# Altium schematic sheet TPS54561_5V_5A_buck.SchDoc
size B; Organization: CWRUbotix; Address1: 10900 Euclid Avenue; Address2: Cleveland, OH 44106; Address3: USA
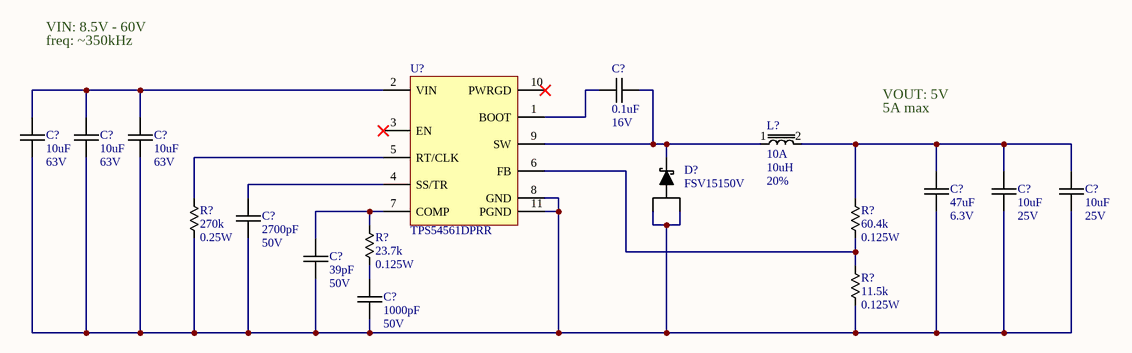
[diagram p0: TPS54561_5V_5A_buck.SchDoc]

## Parts
(Parts that share a designator on the sheet are numbered #1, #2 ... from top to bottom, then left to right.)
C?#1  Capacitance: 0.1uF  Voltage Rating: 16V  [chip_0603]  (hidden comment: cap_single_np)
C?#2  Capacitance: 10uF  Voltage Rating: 63V  [chip_1210]  (hidden comment: cap_single_np)
C?#3  Capacitance: 10uF  Voltage Rating: 63V  [chip_1210]  (hidden comment: cap_single_np)
C?#4  Capacitance: 10uF  Voltage Rating: 63V  [chip_1210]  (hidden comment: cap_single_np)
C?#5  Capacitance: 47uF  Voltage Rating: 6.3V  [chip_1210]  (hidden comment: cap_single_np)
C?#6  Capacitance: 10uF  Voltage Rating: 25V  [chip_1206]  (hidden comment: cap_single_np)
C?#7  Capacitance: 10uF  Voltage Rating: 25V  [chip_1206]  (hidden comment: cap_single_np)
C?#8  Capacitance: 2700pF  Voltage Rating: 50V  [chip_0603]  (hidden comment: cap_single_np)
C?#9  Capacitance: 39pF  Voltage Rating: 50V  [chip_0603]  (hidden comment: cap_single_np)
C?#10  Capacitance: 1000pF  Voltage Rating: 50V  [chip_0603]  (hidden comment: cap_single_np)
D?  Manufacturer PN: FSV15150V  [TO-277-3]  (hidden comment: diode_sch_A12C3)
L?  Current Rating: 10A  Inductance: 10uH  Tolerance: 20%  [BOURNS_SRP1265A]  (hidden comment: ind_1)
R?#1  Resistance: 60.4k  Power Rating: 0.125W  [chip_0805]  (hidden comment: res_single)
R?#2  Resistance: 270k  Power Rating: 0.25W  [chip_0603]  (hidden comment: res_single)
R?#3  Resistance: 23.7k  Power Rating: 0.125W  [chip_0805]  (hidden comment: res_single)
R?#4  Resistance: 11.5k  Power Rating: 0.125W  [chip_0805]  (hidden comment: res_single)
U?  Manufacturer PN: TPS54561DPRR  [WSON-10_0]  (hidden comment: TPS54561)

## Nets
NetC?#1_1: C?#1.1 U?.1(BOOT)
NetC?#1_2: C?#1.2 D?.3 L?.1 U?.9(SW)
NetC?#2_1: C?#2.1 C?#3.1 C?#4.1 U?.2(VIN)
NetC?#2_2: C?#2.2 C?#3.2 C?#4.2 C?#5.2 C?#6.2 C?#7.2 C?#8.1 C?#9.2 C?#10.2 D?.1 D?.2 R?#2.1 R?#4.2 U?.8(GND) U?.11(PGND)
NetC?#5_1: C?#5.1 C?#6.1 C?#7.1 L?.2 R?#1.1
NetC?#8_2: C?#8.2 U?.4(SS/TR)
NetC?#9_1: C?#9.1 R?#3.1 U?.7(COMP)
NetC?#10_1: C?#10.1 R?#3.2
NetR?#1_2: R?#1.2 R?#4.1 U?.6(FB)
NetR?#2_2: R?#2.2 U?.5(RT/CLK)

Not connected (* = marked no-connect by the designer): U? 3(EN)* 10(PWRGD)*

## Notes on the sheet
- VIN: 8.5V - 60V
- freq: ~350kHz
- VOUT: 5V
- 5A max
- Title
- Size:
- B
- Number:
- Revision:
- Date:
- Sheet
- of

## Library data of the parts
C?#1 = CAP-00542: CAP, 0.1uF, ±10%, 16V, X7R, 0603; Manufacturer: Murata; Tolerance: ±10%; Part Number: CAP-00542; Type: X7R
C?#2-C?#4 = CAP-00554: CAP, 10uF, ±10%, 63V, X7R, 1210; Manufacturer: Samsung Electro-Mechanics; Manufacturer PN: CL32B106KMVNNWE; Tolerance: ±10%; Part Number: CAP-00554; Type: X7R; Cost: 0.81
C?#5 = CAP-00557: CAP, 47uF, ±20%, 6.3V, X7R, 1210; Manufacturer: KEMET; Manufacturer PN: C1210C476M9RACTU; Tolerance: ±20%; Part Number: CAP-00557; Type: X7R; Cost: 1.08
C?#6 C?#7 = CAP-00539: CAP, 10uF, ±10%, 25V, X7R, 1206; Manufacturer: Samsung; Manufacturer PN: CL31B106KAHNNNE; Tolerance: ±10%; Part Number: CAP-00539; Type: X7R
C?#8 = CAP-00434: CAP, 2700pF, ±2%, 50V, C0G, 0603; Manufacturer: Murata; Manufacturer PN: GRM1885C1H272GA01D; Tolerance: ±2%; Part Number: CAP-00434; Type: C0G
C?#9 = CAP-00423: CAP, 39pF, ±1%, 50V, C0G, 0603; Manufacturer: Murata; Manufacturer PN: GRM1885C1H390FA01D; Tolerance: ±1%; Part Number: CAP-00423; Type: C0G
C?#10 = CAP-00459: CAP, 1000pF, ±1%, 50V, C0G, 0603; Manufacturer: Murata; Manufacturer PN: GRM1885C1H102FA01J; Tolerance: ±1%; Part Number: CAP-00459; Type: C0G
D? = DIO-00054: Dio, Schottky, 15A, 0.85V, 150V, TO-227; Manufacturer: ON Semi; Current Rating: 15A; Forward Voltage: 0.85V; Type: Schottky; Reverse Breakdown Voltage: 150V; Part Number: DIO-00054; Cost: 0.82
L? = MAG-00107: Ind, 10uH, 10A (15.5A sat.), 20%, 0.0165 Ohm; Manufacturer: Bourns; Manufacturer PN: SRP1265A-100M; DCR: 16.5mOhm; Part Number: MAG-00107; Cost: 1.68
R?#1 = RES-00531: RES SMD 60.4K OHM 1% 1/8W 0805; Manufacturer: Rohm Semiconductor; Manufacturer PN: KTR10EZPF6042; Tolerance: 1%; Part Number: RES-00531
R?#2 = RES-00405: RES SMD 270K OHM 1% 1/4W 0603; Manufacturer: Panasonic; Manufacturer PN: ERJ-PA3F2703V; Tolerance: 1%; Part Number: RES-00405
R?#3 = RES-00392: RES SMD 23.7K OHM 1% 1/8W 0805; Manufacturer: Rohm Semiconductor; Manufacturer PN: KTR10EZPF2372; Tolerance: 1%; Part Number: RES-00392
R?#4 = RES-00309: RES SMD 11.5K OHM 1% 1/8W 0805; Manufacturer: Rohm Semiconductor; Manufacturer PN: KTR10EZPF1152; Tolerance: 1%; Part Number: RES-00309
U? = PWREG-00033: REG, SW Buck Adj, 5A, 4.5-60V, 2.5MHz, TPS54561; Manufacturer: TI; Voltage Range Out: 0.8-58.8V; Frequency: 100kHz-2.5MHz; Reg Type: SW Buck; Part Number: PWREG-00033; Voltage Range In: 4.5-60V; Max Current: 5A; Fixed/Adj: Adj; Cost: 5.52